# EAGLE schematic schema_v4_0_SMD_DIP (EAGLE 6.2)
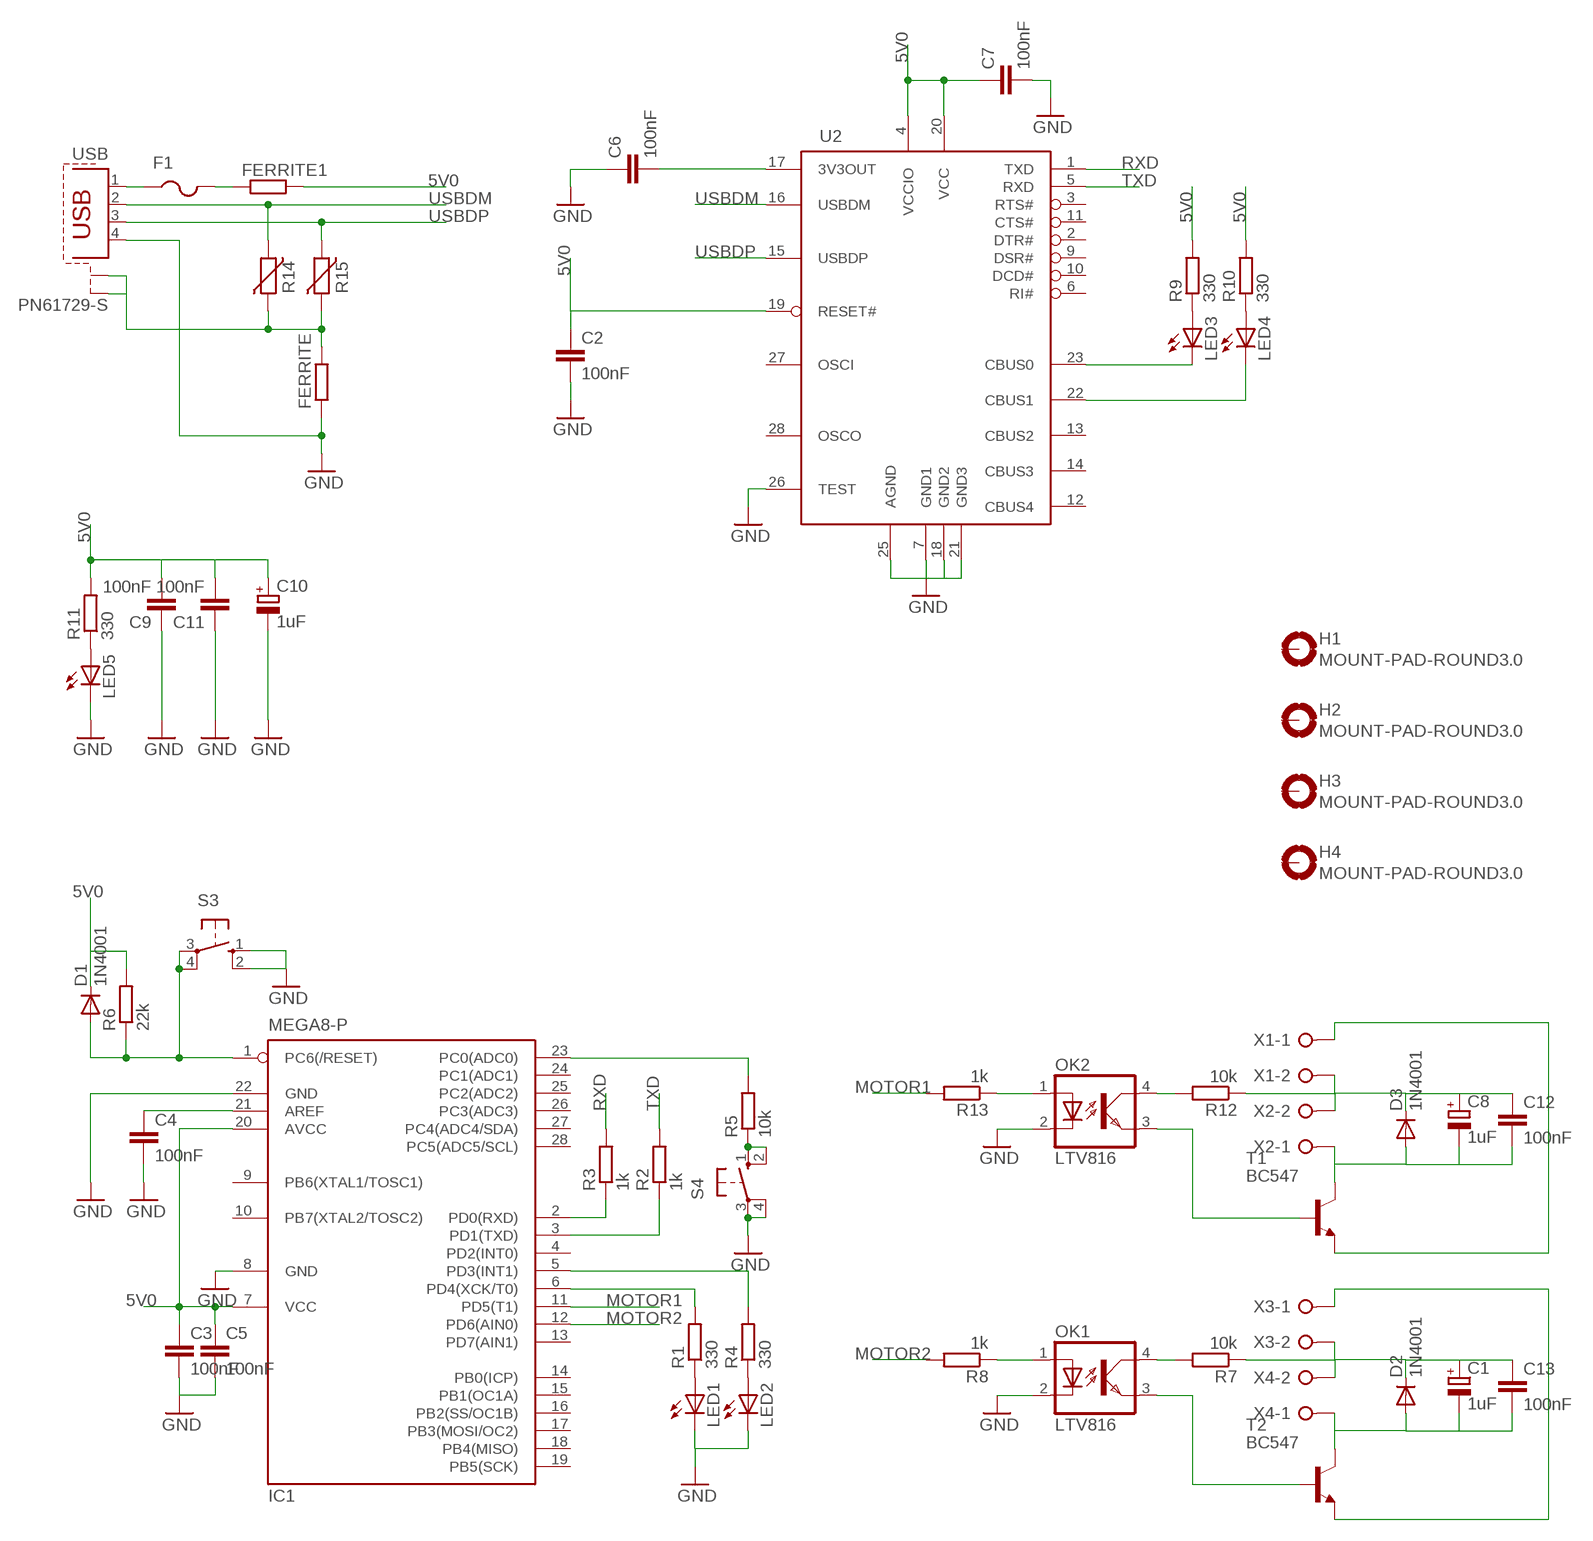
[diagram p0: schematic, sheet 1]

## Parts
C1  1uF  CPOL-EUE2.5-5  [E2,5-5]
C2  100nF  C-EUC0603K  [C0603K]
C3  100nF  C-EU025-025X050  [C025-025X050]
C4  100nF  C-EU025-025X050  [C025-025X050]
C5  100nF  C-EU025-025X050  [C025-025X050]
C6  100nF  C-EUC0603K  [C0603K]
C7  100nF  C-EUC0603K  [C0603K]
C8  1uF  CPOL-EUE2.5-5  [E2,5-5]
C9  100nF  C-EU025-025X050  [C025-025X050]
C10  1uF  CPOL-EUE2.5-5  [E2,5-5]
C11  100nF  C-EU025-025X050  [C025-025X050]
C12  100nF  C-EU025-025X050  [C025-025X050]
C13  100nF  C-EU025-025X050  [C025-025X050]
D1  1N4001  1N4004  [DO41-10]
D2  1N4001  1N4004  [DO41-10]
D3  1N4001  1N4004  [DO41-10]
F1  PTCFUSE-1812  [1812]
FERRITE  R-EU_M0805  [M0805]
FERRITE1  R-EU_M0805  [M0805]
H1  MOUNT-PAD-ROUND3.0  [3,0-PAD]
H2  MOUNT-PAD-ROUND3.0  [3,0-PAD]
H3  MOUNT-PAD-ROUND3.0  [3,0-PAD]
H4  MOUNT-PAD-ROUND3.0  [3,0-PAD]
IC1  MEGA8-P  [DIL28-3]
LED1  LED3MM  [LED3MM]
LED2  LED3MM  [LED3MM]
LED3  LED3MM  [LED3MM]
LED4  LED3MM  [LED3MM]
LED5  LED3MM  [LED3MM]
OK1  LTV816  [DIL04]
OK2  LTV816  [DIL04]
R1  330  R-EU_0207/10  [0207/10]
R2  1k  R-EU_0207/10  [0207/10]
R3  1k  R-EU_0207/10  [0207/10]
R4  330  R-EU_0207/10  [0207/10]
R5  10k  R-EU_0207/10  [0207/10]
R6  22k  R-EU_0207/10  [0207/10]
R7  10k  R-EU_0207/10  [0207/10]
R8  1k  R-EU_0207/10  [0207/10]
R9  330  R-EU_0207/10  [0207/10]
R10  330  R-EU_0207/10  [0207/10]
R11  330  R-EU_0207/10  [0207/10]
R12  10k  R-EU_0207/10  [0207/10]
R13  1k  R-EU_0207/10  [0207/10]
R14  VARISTORCN0603  [CT/CN0603]
R15  VARISTORCN0603  [CT/CN0603]
S3  10-XX  [B3F-10XX]
S4  10-XX  [B3F-10XX]
T1  BC547  [TO92]
T2  BC547  [TO92]
U2  FT232RL  [SSOP28DB]
USB  PN61729-S  [PN61729-S]
X1  W237-02P  [W237-132]
X2  W237-02P  [W237-132]
X3  W237-02P  [W237-132]
X4  W237-02P  [W237-132]

## Nets
5V0: C2.1 C3.1 C5.1 C7.1 C9.2 C10.+ C11.2 D1.C FERRITE1.2 IC1.7(VCC) IC1.20(AVCC) R6.2 R9.2 R10.2 R11.2 U2.4(VCCIO) U2.19(RESET#) U2.20(VCC)
GND: C2.2 C3.2 C4.2 C5.2 C6.1 C7.2 C9.1 C10.- C11.1 FERRITE.1 IC1.8(GND) IC1.22(GND) LED1.K(C) LED2.K(C) LED5.K(C) OK1.2(C) OK2.2(C) S3.1(S) S3.2(S1) S4.3(P) S4.4(P1) U2.26(TEST) USB.4
MOTOR1: IC1.11(PD5(T1)) R13.2
MOTOR2: IC1.12(PD6(AIN0)) R8.2
N$1: IC1.3(PD1(TXD)) R2.1
N$2: IC1.2(PD0(RXD)) R3.1
N$3: C4.1 IC1.21(AREF)
N$4: IC1.23(PC0(ADC0)) R5.2
N$5: LED1.A R1.1
N$6: LED2.A R4.1
N$7: D1.A IC1.1(PC6(/RESET)) R6.1 S3.3(P) S3.4(P1)
N$8: LED3.A R9.1
N$9: LED4.A R10.1
N$10: LED5.A R11.1
N$11: C1.+ C13.1 D2.C R7.1 X3.2 X4.2
N$12: OK2.1(A) R13.1
N$13: C1.- C13.2 D2.A T2.3(C) X4.1
N$14: OK1.3(EMIT) T2.2(B)
N$15: OK2.4(COL) R12.2
N$16: T1.1(E) X1.1
N$17: C8.+ C12.1 D3.C R12.1 X1.2 X2.2
N$18: C8.- C12.2 D3.A T1.3(C) X2.1
N$19: OK2.3(EMIT) T1.2(B)
N$20: F1.1 USB.1
N$21: FERRITE.2 R14.2 R15.2 USB.S1 USB.S2
N$22: F1.2 FERRITE1.1
N$41: LED3.K(C) U2.23(CBUS0)
N$42: LED4.K(C) U2.22(CBUS1)
N$45: R5.1 S4.1(S) S4.2(S1)
N$46: IC1.6(PD4(XCK/T0)) R1.2
N$50: IC1.5(PD3(INT1)) R4.2
N$96: C6.2 U2.17(3V3OUT)
N$102: OK1.1(A) R8.1
N$104: OK1.4(COL) R7.2
N$107: T2.1(E) X3.1
RXD: R3.2 U2.1(TXD)
TXD: R2.2 U2.5(RXD)
USBDM: R14.1 U2.16(USBDM) USB.2
USBDP: R15.1 U2.15(USBDP) USB.3
Unconnected: H1.B3,0(MOUNT) H2.B3,0(MOUNT) H3.B3,0(MOUNT) H4.B3,0(MOUNT) IC1.4(PD2(INT0)) IC1.9(PB6(XTAL1/TOSC1)) IC1.10(PB7(XTAL2/TOSC2)) IC1.13(PD7(AIN1)) IC1.14(PB0(ICP)) IC1.15(PB1(OC1A)) IC1.16(PB2(SS/OC1B)) IC1.17(PB3(MOSI/OC2)) IC1.18(PB4(MISO)) IC1.19(PB5(SCK)) IC1.24(PC1(ADC1)) IC1.25(PC2(ADC2)) IC1.26(PC3(ADC3)) IC1.27(PC4(ADC4/SDA)) IC1.28(PC5(ADC5/SCL)) U2.2(DTR#) U2.3(RTS#) U2.6(RI#) U2.9(DSR#) U2.10(DCD#) U2.11(CTS#) U2.12(CBUS4) U2.13(CBUS2) U2.14(CBUS3) U2.27(OSCI) U2.28(OSCO)

## Power pins joined to a net without a drawn wire
AGND: U2.25(AGND)
GND1: U2.7(GND1)
GND2: U2.18(GND2)
GND3: U2.21(GND3)

## Library data of the parts
C1 C8 C10 = rcl:CPOL-EU: POLARIZED CAPACITOR, European symbol
C2-C7 C9 C11-C13 = rcl:C-EU: CAPACITOR, European symbol
D1-D3 = diode:1N4004: DIODE general purpose rectifier, 1 A
F1 = adafruit:PTCFUSE: PTC fuses, resettable thermistors
FERRITE FERRITE1 = resistor:R-EU_: RESISTOR, European symbol
H1-H4 = holes:MOUNT-PAD-ROUND: MOUNTING PAD, round
IC1 = atmel:MEGA8-P: MICROCONTROLLER 8 Kbytes FLASH, 1 kbytes SRAM, 512 bytes EEPROM, USART, 4-channel 10 bit ADC, 2-channel 8 bit ADC Pin compatible with Atmega48, ATMega88, ATMega168 Source: avr.lbr; OC_FARNELL: unknown; OC_NEWARK: unknown
LED1-LED5 = led:LED: LED OSRAM: - CHIPLED LG R971, LG N971, LY N971, LG Q971, LY Q971, LO R971, LY R971 LH N974, LH R974 LS Q976, LO Q976, LY Q976 LO Q996 - Hyper CHIPLED LW Q18S LB Q993, LB Q99A, LB R99A - SideLED LS A670, LO A670, LY A670, LG A670, LP A670 LB A673, LV A673, LT A673, LW A673 LH A674 LY A675 LS A676, LA A676, LO A676, LY A676, LW A676 LS A679, LY A679, LG A679 - Hyper Micro SIDELED® LS Y876, LA Y876, LO Y876, LY Y876 LT Y87S - SmartLED LW L88C, LW L88S LB L89C, LB L89S, LG L890 LS L89K, LO L89K, LY L89K LS L896, LA L896, LO L896, LY L896 - TOPLED LS T670, LO T670, LY T670, LG T670, LP T670 LSG T670, LSP T670, LSY T670, LOP T670, LYG T670 LG T671, LOG T671, LSG T671 LB T673, LV T673, LT T673, LW T673 LH T674 LS T676, LA T676, LO T676, LY T676, LB T676, LH T676, LSB T676, LW T676 LB T67C, LV T67C, LT T67C, LS T67K, LO T67K, LY T67K, LW E67C LS E67B, LA E67B, LO E67B, LY E67B, LB E67C, LV E67C, LT E67C LW T67C LS T679, LY T679, LG T679 LS T770, LO T770, LY T770, LG T770, LP T770 LB T773, LV T773, LT T773, LW T773 LH T774 LS E675, LA E675, LY E675, LS T675 LS T776, LA T776, LO T776, LY T776, LB T776 LHGB T686 LT T68C, LB T68C - Hyper Mini TOPLED® LB M676 - Mini TOPLED Santana® LG M470 LS M47K, LO M47K, LY M47K Source: http://www.osram.convergy.de LUXEON: - LUMILED® LXK2-PW12-R00, LXK2-PW12-S00, LXK2-PW14-U00, LXK2-PW14-V00 LXK2-PM12-R00, LXK2-PM12-S00, LXK2-PM14-U00 LXK2-PE12-Q00, LXK2-PE12-R00, LXK2-PE12-S00, LXK2-PE14-T00, LXK2-PE14-U00 LXK2-PB12-K00, LXK2-PB12-L00, LXK2-PB12-M00, LXK2-PB14-N00, LXK2-PB14-P00, LXK2-PB14-Q00 LXK2-PR12-L00, LXK2-PR12-M00, LXK2-PR14-Q00, LXK2-PR14-R00 LXK2-PD12-Q00, LXK2-PD12-R00, LXK2-PD12-S00 LXK2-PH12-R00, LXK2-PH12-S00 LXK2-PL12-P00, LXK2-PL12-Q00, LXK2-PL12-R00 Source: www.luxeon.com KINGBRIGHT: KA-3528ASYC Source: www.kingbright.com
OK1 OK2 = optocoupler:LTV816: OPTO COUPLER Source: LITEON, LTV816.pdf; OC_FARNELL: unknown; OC_NEWARK: unknown
R1-R13 = rcl:R-EU_: RESISTOR, European symbol
R14 R15 = varistor:VARISTOR: VARISTOR
S3 S4 = switch-omron:10-XX: OMRON SWITCH; MPN: B3F-1000; OC_FARNELL: 176432; OC_NEWARK: 36M3542
T1 T2 = transistor:BC547: NPN TRANSISTOR
U2 = ftdichip-5:FT232RL: USB UART 4th Generation USB UART (USB <-> Serial) Controller
USB = con-berg:PN61729-S: BERG USB connector; OC_FARNELL: unknown; OC_NEWARK: unknown
X1-X4 = con-wago-508:W237-02P: WAGO SREW CLAMP; OC_FARNELL: unknown; OC_NEWARK: unknown

## Net classes
0 default: width 0.203 mm